# Altium schematic sheet catalog.SchDoc
size A4; Author: whutddk; DrawnBy: WHUTDDK; Revision: 1.0
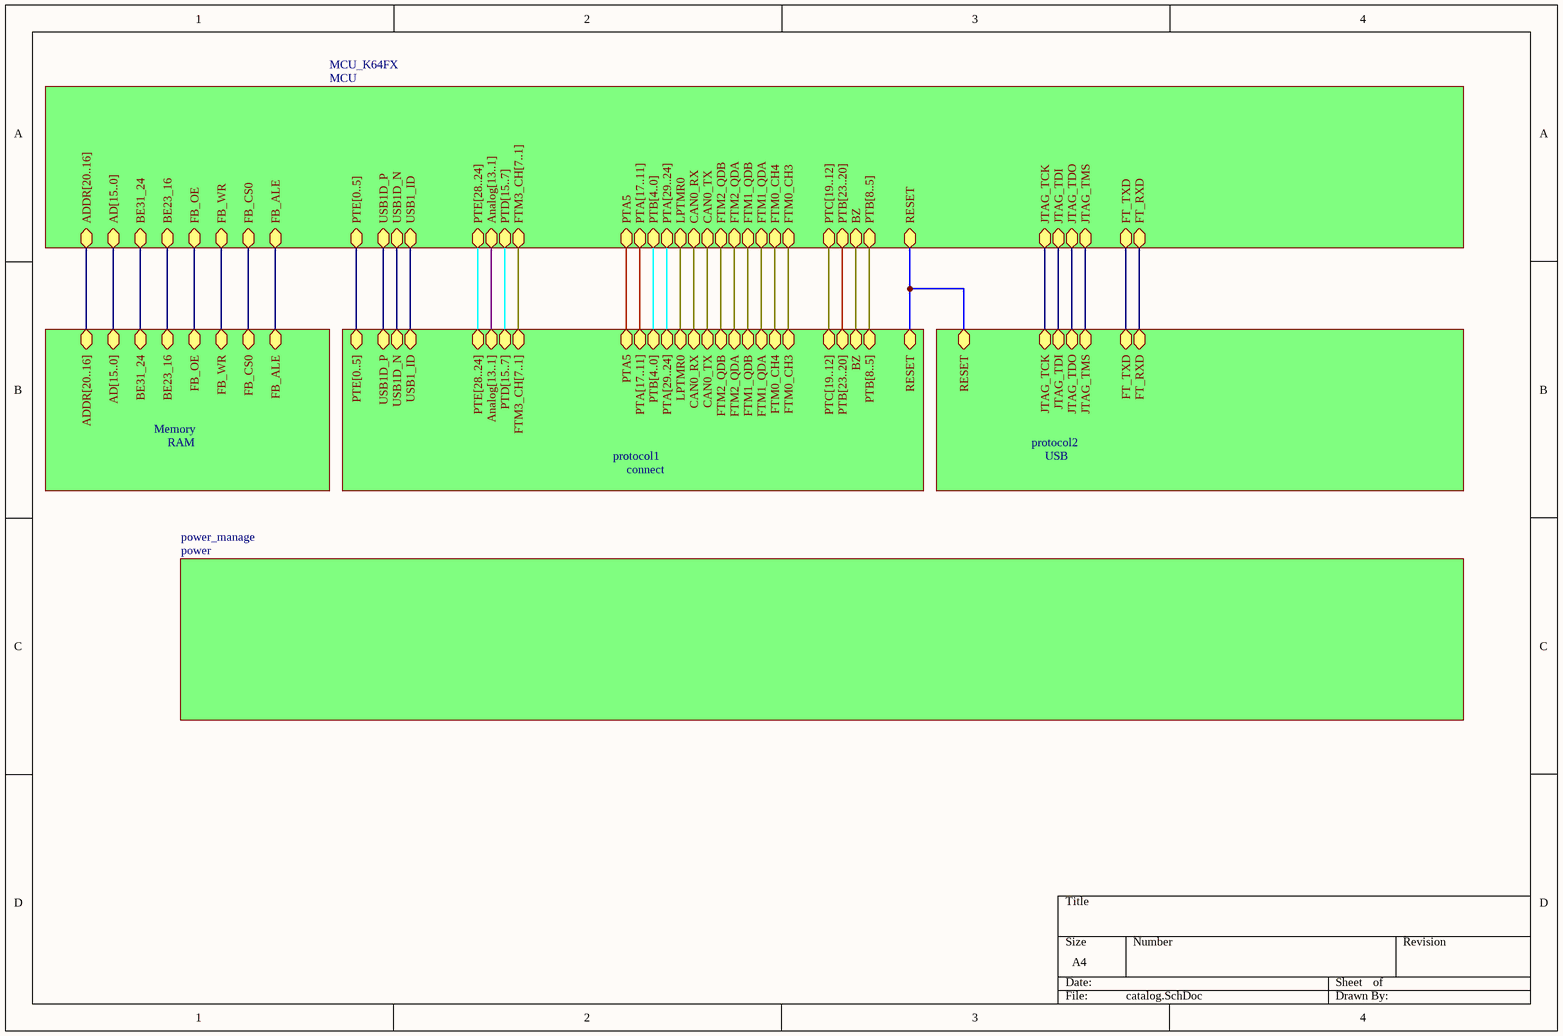
[diagram p0: catalog.SchDoc]

## Sub-sheets
MCU_K64FX = MCU: PTE[0..5], ADDR[20..16], AD[15..0], BE31_24, BE23_16, FB_OE, FB_WR, FB_CS0, FB_ALE, JTAG_TCK, JTAG_TDI, JTAG_TDO, JTAG_TMS, USB1D_P, USB1D_N, USB1_ID, FT_TXD, FT_RXD, RESET, FTM0_CH3, FTM0_CH4, FTM1_QDA, FTM1_QDB, FTM2_QDB, FTM2_QDA, CAN0_RX, CAN0_TX, LPTMR0, PTA[29..24], PTB[4..0], PTA[17..11], PTA5, FTM3_CH[7..1], PTD[15..7], Analog[13..1], PTE[28..24], PTB[23..20], PTB[8..5], BZ, PTC[19..12]
Memory = RAM: ADDR[20..16], AD[15..0], BE31_24, BE23_16, FB_OE, FB_WR, FB_CS0, FB_ALE
power_manage = power: no entries
protocol1 = connect: PTE[0..5], USB1D_P, USB1D_N, USB1_ID, RESET, FTM0_CH3, FTM0_CH4, FTM1_QDA, FTM1_QDB, FTM2_QDB, FTM2_QDA, CAN0_RX, CAN0_TX, LPTMR0, PTA[29..24], PTB[4..0], PTA[17..11], PTA5, FTM3_CH[7..1], PTD[15..7], Analog[13..1], PTE[28..24], PTB[23..20], PTB[8..5], BZ, PTC[19..12]
protocol2 = USB: JTAG_TCK, JTAG_TDI, JTAG_TDO, JTAG_TMS, FT_TXD, FT_RXD, RESET

## Nets
(unnamed): sheet MCU_K64FX/BE31_24, sheet Memory/BE31_24
(unnamed): sheet MCU_K64FX/BE23_16, sheet Memory/BE23_16
(unnamed): sheet MCU_K64FX/FB_OE, sheet Memory/FB_OE
(unnamed): sheet MCU_K64FX/FB_WR, sheet Memory/FB_WR
(unnamed): sheet MCU_K64FX/FB_CS0, sheet Memory/FB_CS0
(unnamed): sheet MCU_K64FX/FB_ALE, sheet Memory/FB_ALE
(unnamed): sheet MCU_K64FX/JTAG_TCK, sheet protocol2/JTAG_TCK
(unnamed): sheet MCU_K64FX/JTAG_TDI, sheet protocol2/JTAG_TDI
(unnamed): sheet MCU_K64FX/JTAG_TDO, sheet protocol2/JTAG_TDO
(unnamed): sheet MCU_K64FX/JTAG_TMS, sheet protocol2/JTAG_TMS
(unnamed): sheet MCU_K64FX/USB1D_P, sheet protocol1/USB1D_P
(unnamed): sheet MCU_K64FX/USB1D_N, sheet protocol1/USB1D_N
(unnamed): sheet MCU_K64FX/USB1_ID, sheet protocol1/USB1_ID
(unnamed): sheet MCU_K64FX/FT_TXD, sheet protocol2/FT_TXD
(unnamed): sheet MCU_K64FX/FT_RXD, sheet protocol2/FT_RXD
(unnamed): sheet MCU_K64FX/RESET, sheet protocol1/RESET, sheet protocol2/RESET
(unnamed): sheet MCU_K64FX/FTM0_CH3, sheet protocol1/FTM0_CH3
(unnamed): sheet MCU_K64FX/FTM0_CH4, sheet protocol1/FTM0_CH4
(unnamed): sheet MCU_K64FX/FTM1_QDA, sheet protocol1/FTM1_QDA
(unnamed): sheet MCU_K64FX/FTM1_QDB, sheet protocol1/FTM1_QDB
(unnamed): sheet MCU_K64FX/FTM2_QDB, sheet protocol1/FTM2_QDB
(unnamed): sheet MCU_K64FX/FTM2_QDA, sheet protocol1/FTM2_QDA
(unnamed): sheet MCU_K64FX/CAN0_RX, sheet protocol1/CAN0_RX
(unnamed): sheet MCU_K64FX/CAN0_TX, sheet protocol1/CAN0_TX
(unnamed): sheet MCU_K64FX/LPTMR0, sheet protocol1/LPTMR0
(unnamed): sheet MCU_K64FX/PTA5, sheet protocol1/PTA5
(unnamed): sheet MCU_K64FX/BZ, sheet protocol1/BZ

## Buses and harness runs
bus sheet MCU_K64FX/AD[15..0] = sheet Memory/AD[15..0]
bus sheet MCU_K64FX/ADDR[20..16] = sheet Memory/ADDR[20..16]
bus sheet MCU_K64FX/Analog[13..1] = sheet protocol1/Analog[13..1]
bus sheet MCU_K64FX/FTM3_CH[7..1] = sheet protocol1/FTM3_CH[7..1]
bus sheet MCU_K64FX/PTA[17..11] = sheet protocol1/PTA[17..11]
bus sheet MCU_K64FX/PTA[29..24] = sheet protocol1/PTA[29..24]
bus sheet MCU_K64FX/PTB[4..0] = sheet protocol1/PTB[4..0]
bus sheet MCU_K64FX/PTB[8..5] = sheet protocol1/PTB[8..5]
bus sheet MCU_K64FX/PTB[23..20] = sheet protocol1/PTB[23..20]
bus sheet MCU_K64FX/PTC[19..12] = sheet protocol1/PTC[19..12]
bus sheet MCU_K64FX/PTD[15..7] = sheet protocol1/PTD[15..7]
bus sheet MCU_K64FX/PTE[0..5] = sheet protocol1/PTE[0..5]
bus sheet MCU_K64FX/PTE[28..24] = sheet protocol1/PTE[28..24]